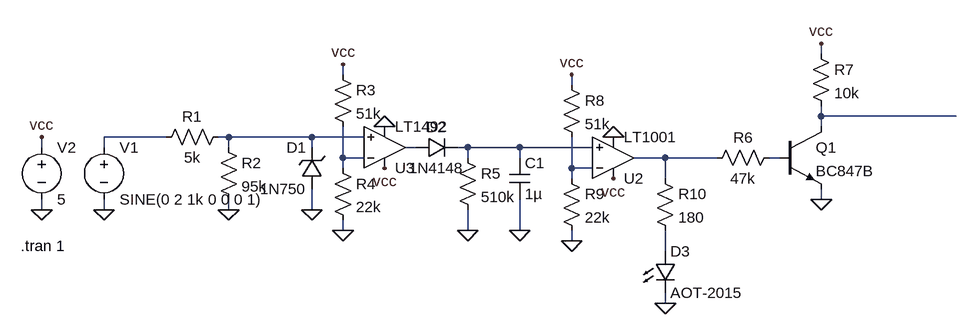
[diagram p0: schematic jeopardy.asc]
jeopardy.asc, the LTspice schematic file:
Version 4
SHEET 1 1684 680
WIRE 1104 -32 1104 -48
WIRE 368 0 368 -16
WIRE 720 16 720 0
WIRE 1104 64 1104 48
WIRE 1312 64 1104 64
WIRE 1104 80 1104 64
WIRE 96 96 0 96
WIRE 192 96 176 96
WIRE 320 96 192 96
WIRE 400 96 320 96
WIRE -96 112 -96 96
WIRE 0 112 0 96
WIRE 192 112 192 96
WIRE 320 112 320 96
WIRE 480 112 464 112
WIRE 560 112 544 112
WIRE 640 112 560 112
WIRE 752 112 640 112
WIRE 368 128 368 80
WIRE 400 128 368 128
WIRE 560 128 560 112
WIRE 640 128 640 112
WIRE 864 128 816 128
WIRE 944 128 864 128
WIRE 1040 128 1024 128
WIRE 368 144 368 128
WIRE 720 144 720 96
WIRE 752 144 720 144
WIRE 720 160 720 144
WIRE 864 160 864 128
WIRE 1104 192 1104 176
WIRE -96 208 -96 192
WIRE 0 208 0 192
WIRE 192 208 192 192
WIRE 320 208 320 176
WIRE 368 240 368 224
WIRE 560 240 560 208
WIRE 640 240 640 192
WIRE 720 256 720 240
WIRE 864 272 864 240
WIRE 864 352 864 336
FLAG 0 208 0
FLAG 192 208 0
FLAG 320 208 0
FLAG 432 80 0
FLAG -96 208 0
FLAG -96 96 vcc
FLAG 432 144 vcc
FLAG 368 -16 vcc
FLAG 368 240 0
FLAG 560 240 0
FLAG 640 240 0
FLAG 1104 192 0
FLAG 1104 -48 vcc
FLAG 720 0 vcc
FLAG 720 256 0
FLAG 784 160 vcc
FLAG 784 96 0
FLAG 864 352 0
SYMBOL voltage 0 96 R0
WINDOW 123 0 0 Left 2
WINDOW 39 0 0 Left 2
SYMATTR InstName V1
SYMATTR Value SINE(0 2 1k 0 0 0 1)
SYMBOL res 80 112 R270
WINDOW 0 32 56 VTop 2
WINDOW 3 0 56 VBottom 2
SYMATTR InstName R1
SYMATTR Value 5k
SYMBOL res 176 96 R0
SYMATTR InstName R2
SYMATTR Value 95k
SYMBOL zener 336 176 R180
WINDOW 0 24 64 Left 2
WINDOW 3 24 0 Left 2
SYMATTR InstName D1
SYMATTR Value 1N750
SYMATTR Description Diode
SYMATTR Type diode
SYMBOL voltage -96 96 R0
WINDOW 123 0 0 Left 2
WINDOW 39 0 0 Left 2
SYMATTR InstName V2
SYMATTR Value 5
SYMBOL res 352 -16 R0
SYMATTR InstName R3
SYMATTR Value 51k
SYMBOL res 352 128 R0
SYMATTR InstName R4
SYMATTR Value 22k
SYMBOL diode 480 128 R270
WINDOW 0 32 32 VTop 2
WINDOW 3 0 32 VBottom 2
SYMATTR InstName D2
SYMATTR Value 1N4148
SYMBOL res 544 112 R0
SYMATTR InstName R5
SYMATTR Value 510k
SYMBOL cap 624 128 R0
SYMATTR InstName C1
SYMATTR Value 1µ
SYMBOL res 1040 112 R90
WINDOW 0 0 56 VBottom 2
WINDOW 3 32 56 VTop 2
SYMATTR InstName R6
SYMATTR Value 47k
SYMBOL npn 1040 80 R0
SYMATTR InstName Q1
SYMATTR Value BC847B
SYMBOL Opamps\\LT1001 784 192 M180
SYMATTR InstName U2
SYMBOL res 1088 -48 R0
SYMATTR InstName R7
SYMATTR Value 10k
SYMBOL res 704 0 R0
SYMATTR InstName R8
SYMATTR Value 51k
SYMBOL res 704 144 R0
SYMATTR InstName R9
SYMATTR Value 22k
SYMBOL res 848 144 R0
SYMATTR InstName R10
SYMATTR Value 180
SYMBOL LED 848 272 R0
SYMATTR InstName D3
SYMATTR Value AOT-2015
SYMATTR Description Diode
SYMATTR Type diode
SYMBOL Opamps\\LT1492 432 176 M180
SYMATTR InstName U3
TEXT -128 264 Left 2 !.tran 1

The netlist it stands for:
* jeopardy.asc
V1 N002 0 SINE(0 2 1k 0 0 0 1)
R1 N002 N003 5k
R2 N003 0 95k
D1 0 N003 1N750
V2 vcc 0 5
R3 vcc N006 51k
R4 N006 0 22k
D2 N004 N005 1N4148
R5 N005 0 510k
C1 N005 0 1µ
R6 N008 N007 47k
Q1 N001 N008 0 0 BC847B
XU2 N005 N009 vcc 0 N007 LT1001  ; pins In+ In- V+ V- OUT
R7 vcc N001 10k
R8 vcc N009 51k
R9 N009 0 22k
R10 N007 N010 180
D3 N010 0 AOT-2015
XU3 N003 N006 vcc 0 N004 LT1492  ; pins In+ In- V+ V- OUT
.model D D
.lib standard.dio
.model NPN NPN
.model PNP PNP
.lib standard.bjt
.tran 1
.lib LTC.lib
.backanno
.end